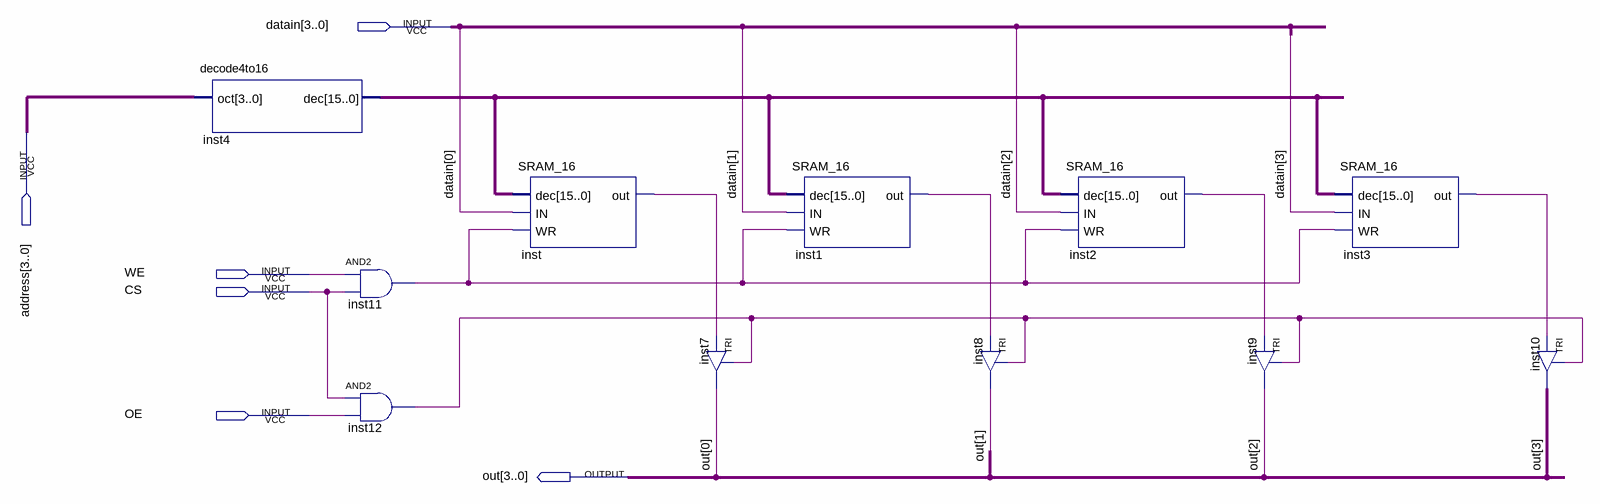
[diagram p0: schematic sheet]
// Quartus schematic SRAM_16Times4.bdf as structural Verilog: 11 symbols, 6 pins
module SRAM_16Times4 (
  input  [3:0] datain,
  input  [3:0] address,
  input  WE,
  input  CS,
  input  OE,
  output [3:0] out
);

  wire inst1_out, inst2_out, inst3_out, inst11_out, inst12_out, inst_out;
  wire [15:0] inst4_dec;

  decode4to16 inst4 (.oct(address), .dec(inst4_dec));
  and inst11 (inst11_out, WE, CS);
  and inst12 (inst12_out, CS, OE);
  SRAM_16 inst (.dec(inst4_dec), .IN(datain[0]), .WR(inst11_out), .out(inst_out));
  TRI inst7 (.IN(inst_out), .OE(inst12_out), .OUT(out[0]));
  SRAM_16 inst1 (.dec(inst4_dec), .IN(datain[1]), .WR(inst11_out), .out(inst1_out));
  TRI inst8 (.IN(inst1_out), .OE(inst12_out), .OUT(out[1]));
  SRAM_16 inst2 (.dec(inst4_dec), .IN(datain[2]), .WR(inst11_out), .out(inst2_out));
  TRI inst9 (.IN(inst2_out), .OE(inst12_out), .OUT(out[2]));
  SRAM_16 inst3 (.dec(inst4_dec), .IN(datain[3]), .WR(inst11_out), .out(inst3_out));
  TRI inst10 (.IN(inst3_out), .OE(inst12_out), .OUT(out[3]));
endmodule
